# EAGLE design comcon_version_av2 (EAGLE 6.5.0)
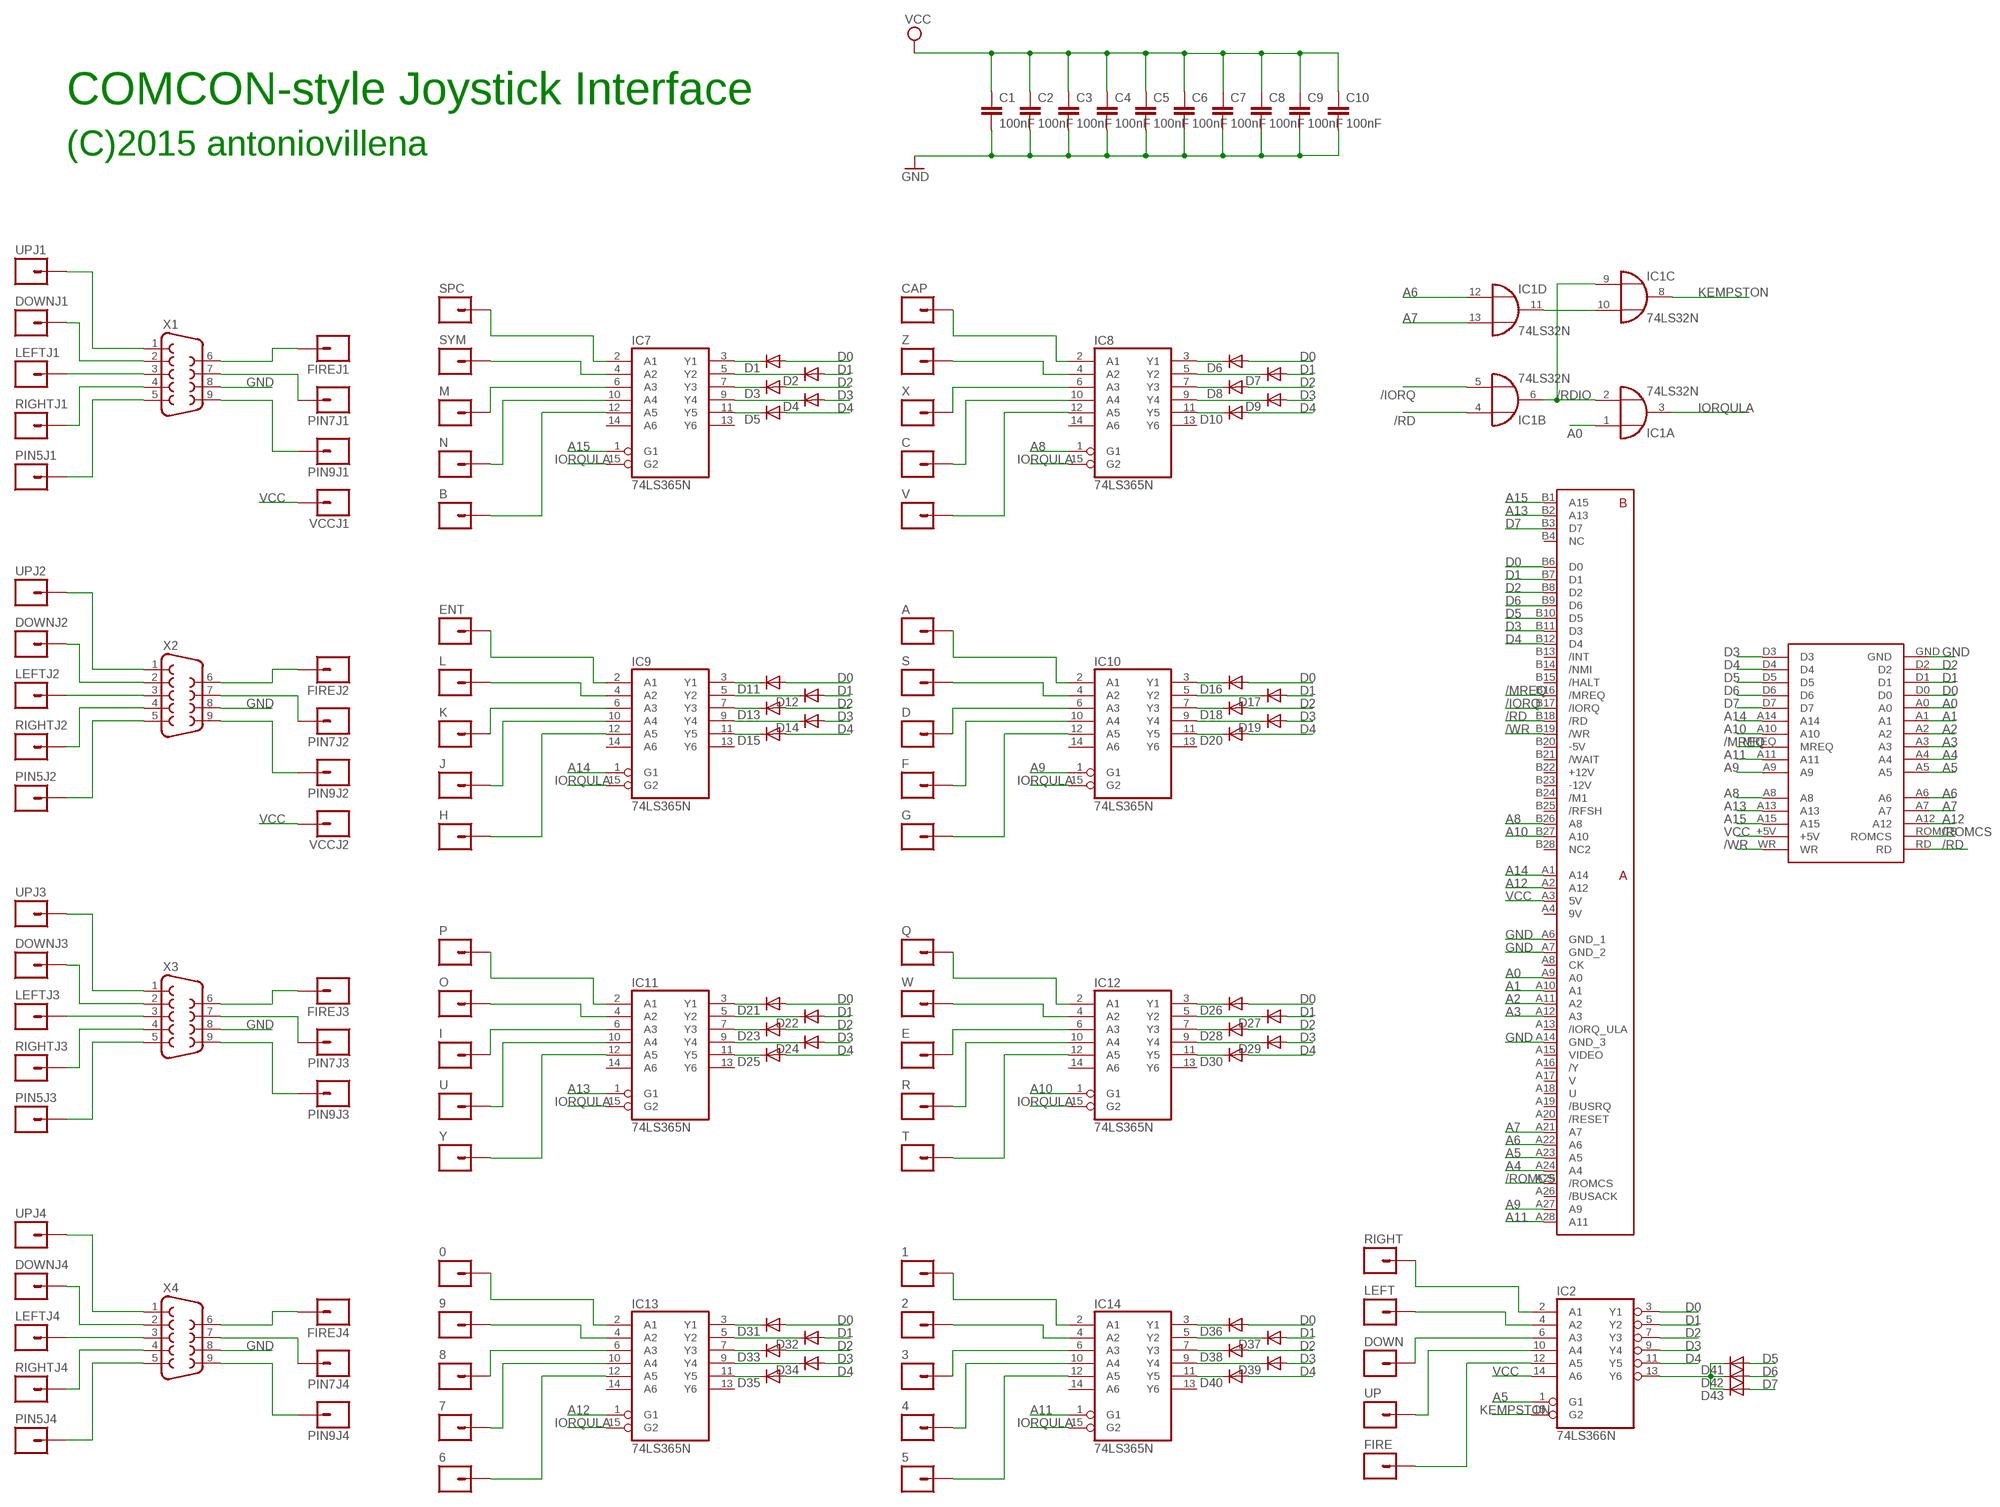
[diagram p0: schematic, sheet 1]

## Parts
0  M01PTH  [1X01]
1  M01PTH  [1X01]
2  M01PTH  [1X01]
3  M01PTH  [1X01]
4  M01PTH  [1X01]
5  M01PTH  [1X01]
6  M01PTH  [1X01]
7  M01PTH  [1X01]
8  M01PTH  [1X01]
9  M01PTH  [1X01]
A  M01PTH  [1X01]
B  M01PTH  [1X01]
C  M01PTH  [1X01]
C1  100nF  C-EU050-025X075  [C050-025X075]
C2  100nF  C-EU050-025X075  [C050-025X075]
C3  100nF  C-EU050-025X075  [C050-025X075]
C4  100nF  C-EU050-025X075  [C050-025X075]
C5  100nF  C-EU050-025X075  [C050-025X075]
C6  100nF  C-EU050-025X075  [C050-025X075]
C7  100nF  C-EU050-025X075  [C050-025X075]
C8  100nF  C-EU050-025X075  [C050-025X075]
C9  100nF  C-EU050-025X075  [C050-025X075]
C10  100nF  C-EU050-025X075  [C050-025X075]
CAP  M01PTH  [1X01]
D  M01PTH  [1X01]
D1  1N4148DO35-7  [DO35-7]
D2  1N4148DO35-7  [DO35-7]
D3  1N4148DO35-7  [DO35-7]
D4  1N4148DO35-7  [DO35-7]
D5  1N4148DO35-7  [DO35-7]
D6  1N4148DO35-7  [DO35-7]
D7  1N4148DO35-7  [DO35-7]
D8  1N4148DO35-7  [DO35-7]
D9  1N4148DO35-7  [DO35-7]
D10  1N4148DO35-7  [DO35-7]
D11  1N4148DO35-7  [DO35-7]
D12  1N4148DO35-7  [DO35-7]
D13  1N4148DO35-7  [DO35-7]
D14  1N4148DO35-7  [DO35-7]
D15  1N4148DO35-7  [DO35-7]
D16  1N4148DO35-7  [DO35-7]
D17  1N4148DO35-7  [DO35-7]
D18  1N4148DO35-7  [DO35-7]
D19  1N4148DO35-7  [DO35-7]
D20  1N4148DO35-7  [DO35-7]
D21  1N4148DO35-7  [DO35-7]
D22  1N4148DO35-7  [DO35-7]
D23  1N4148DO35-7  [DO35-7]
D24  1N4148DO35-7  [DO35-7]
D25  1N4148DO35-7  [DO35-7]
D26  1N4148DO35-7  [DO35-7]
D27  1N4148DO35-7  [DO35-7]
D28  1N4148DO35-7  [DO35-7]
D29  1N4148DO35-7  [DO35-7]
D30  1N4148DO35-7  [DO35-7]
D31  1N4148DO35-7  [DO35-7]
D32  1N4148DO35-7  [DO35-7]
D33  1N4148DO35-7  [DO35-7]
D34  1N4148DO35-7  [DO35-7]
D35  1N4148DO35-7  [DO35-7]
D36  1N4148DO35-7  [DO35-7]
D37  1N4148DO35-7  [DO35-7]
D38  1N4148DO35-7  [DO35-7]
D39  1N4148DO35-7  [DO35-7]
D40  1N4148DO35-7  [DO35-7]
D41  1N4148DO35-10  [DO35-10]
D42  1N4148DO35-10  [DO35-10]
D43  1N4148DO35-7  [DO35-7]
DOWN  M01PTH  [1X01]
DOWNJ1  M01PTH  [1X01]
DOWNJ2  M01PTH  [1X01]
DOWNJ3  M01PTH  [1X01]
DOWNJ4  M01PTH  [1X01]
E  M01PTH  [1X01]
ENT  M01PTH  [1X01]
F  M01PTH  [1X01]
FIRE  M01PTH  [1X01]
FIREJ1  M01PTH  [1X01]
FIREJ2  M01PTH  [1X01]
FIREJ3  M01PTH  [1X01]
FIREJ4  M01PTH  [1X01]
G  M01PTH  [1X01]
H  M01PTH  [1X01]
I  M01PTH  [1X01]
IC1  74LS32N  [DIL14]
IC2  74LS366N  [DIL16]
IC7  74LS365N  74HC365N  [DIL16]
IC8  74LS365N  74HC365N  [DIL16]
IC9  74LS365N  74HC365N  [DIL16]
IC10  74LS365N  74HC365N  [DIL16]
IC11  74LS365N  74HC365N  [DIL16]
IC12  74LS365N  74HC365N  [DIL16]
IC13  74LS365N  74HC365N  [DIL16]
IC14  74LS365N  74HC365N  [DIL16]
J  M01PTH  [1X01]
K  M01PTH  [1X01]
L  M01PTH  [1X01]
LEFT  M01PTH  [1X01]
LEFTJ1  M01PTH  [1X01]
LEFTJ2  M01PTH  [1X01]
LEFTJ3  M01PTH  [1X01]
LEFTJ4  M01PTH  [1X01]
M  M01PTH  [1X01]
N  M01PTH  [1X01]
O  M01PTH  [1X01]
P  M01PTH  [1X01]
PIN5J1  M01PTH  [1X01]
PIN5J2  M01PTH  [1X01]
PIN5J3  M01PTH  [1X01]
PIN5J4  M01PTH  [1X01]
PIN7J1  M01PTH  [1X01]
PIN7J2  M01PTH  [1X01]
PIN7J3  M01PTH  [1X01]
PIN7J4  M01PTH  [1X01]
PIN9J1  M01PTH  [1X01]
PIN9J2  M01PTH  [1X01]
PIN9J3  M01PTH  [1X01]
PIN9J4  M01PTH  [1X01]
Q  M01PTH  [1X01]
R  M01PTH  [1X01]
RIGHT  M01PTH  [1X01]
RIGHTJ1  M01PTH  [1X01]
RIGHTJ2  M01PTH  [1X01]
RIGHTJ3  M01PTH  [1X01]
RIGHTJ4  M01PTH  [1X01]
S  M01PTH  [1X01]
SPC  M01PTH  [1X01]
SYM  M01PTH  [1X01]
T  M01PTH  [1X01]
U  M01PTH  [1X01]
U$1  ZX_CARTRIDGE  [ZX_CARTRIDGE]
U$3  ZXSP_ED2X28_SPE  [2X28_SPE]
UP  M01PTH  [1X01]
UPJ1  M01PTH  [1X01]
UPJ2  M01PTH  [1X01]
UPJ3  M01PTH  [1X01]
UPJ4  M01PTH  [1X01]
V  M01PTH  [1X01]
VCCJ1  M01PTH  [1X01]
VCCJ2  M01PTH  [1X01]
W  M01PTH  [1X01]
X  M01PTH  [1X01]
X1  F09D  [F09D]
X2  F09D  [F09D]
X3  F09D  [F09D]
X4  F09D  [F09D]
Y  M01PTH  [1X01]
Z  M01PTH  [1X01]

## Nets
/IORQ: IC1.5(B:I1) U$3.B17(/IORQ)
/MREQ: U$1.MREQ U$3.B16(/MREQ)
/RD: IC1.4(B:I0) U$1.RD U$3.B18(/RD)
/RDIO: IC1.2(A:I1) IC1.6(B:O) IC1.9(C:I0)
/ROMCS: U$1.ROMCS U$3.A25(/ROMCS)
/WR: U$1.WR U$3.B19(/WR)
A0: IC1.1(A:I0) U$1.A0 U$3.A9(A0)
A1: U$1.A1 U$3.A10(A1)
A2: U$1.A2 U$3.A11(A2)
A3: U$1.A3 U$3.A12(A3)
A4: U$1.A4 U$3.A24(A4)
A5: IC2.1(G1) U$1.A5 U$3.A23(A5)
A6: IC1.12(D:I0) U$1.A6 U$3.A22(A6)
A7: IC1.13(D:I1) U$1.A7 U$3.A21(A7)
A8: IC8.1(G1) U$1.A8 U$3.B26(A8)
A9: IC10.1(G1) U$1.A9 U$3.A27(A9)
A10: IC12.1(G1) U$1.A10 U$3.B27(A10)
A11: IC14.1(G1) U$1.A11 U$3.A28(A11)
A12: IC13.1(G1) U$1.A12 U$3.A2(A12)
A13: IC11.1(G1) U$1.A13 U$3.B2(A13)
A14: IC9.1(G1) U$1.A14 U$3.A1(A14)
A15: IC7.1(G1) U$1.A15 U$3.B1(A15)
D0: D1.A D6.A D11.A D16.A D21.A D26.A D31.A D36.A IC2.3(Y1) U$1.D0 U$3.B6(D0)
D1: D2.A D7.A D12.A D17.A D22.A D27.A D32.A D37.A IC2.5(Y2) U$1.D1 U$3.B7(D1)
D2: D3.A D8.A D13.A D18.A D23.A D28.A D33.A D38.A IC2.7(Y3) U$1.D2 U$3.B8(D2)
D3: D4.A D9.A D14.A D19.A D24.A D29.A D34.A D39.A IC2.9(Y4) U$1.D3 U$3.B11(D3)
D4: D5.A D10.A D15.A D20.A D25.A D30.A D35.A D40.A IC2.11(Y5) U$1.D4 U$3.B12(D4)
D5: D41.A U$1.D5 U$3.B10(D5)
D6: D42.A U$1.D6 U$3.B9(D6)
D7: D43.A U$1.D7 U$3.B3(D7)
GND [power]: C1.2 C2.2 C3.2 C4.2 C5.2 C6.2 C7.2 C8.2 C9.2 C10.2 U$1.GND U$3.A6(GND_1) U$3.A7(GND_2) U$3.A14(GND_3) X1.8 X2.8 X3.8 X4.8
IORQULA: IC1.3(A:O) IC7.15(G2) IC8.15(G2) IC9.15(G2) IC10.15(G2) IC11.15(G2) IC12.15(G2) IC13.15(G2) IC14.15(G2)
KEMPSTON: IC1.8(C:O) IC2.15(G2)
N$1: D41.C D42.C D43.C IC2.13(Y6)
N$2: IC7.2(A1) SPC.1
N$3: D1.C IC7.3(Y1)
N$4: IC1.10(C:I1) IC1.11(D:O)
N$5: UPJ1.1 X1.1
N$6: DOWNJ1.1 X1.2
N$7: LEFTJ1.1 X1.3
N$8: RIGHTJ1.1 X1.4
N$9: PIN5J1.1 X1.5
N$10: FIREJ1.1 X1.6
N$11: PIN9J1.1 X1.9
N$12: IC7.4(A2) SYM.1
N$13: UPJ2.1 X2.1
N$14: DOWNJ2.1 X2.2
N$15: LEFTJ2.1 X2.3
N$16: RIGHTJ2.1 X2.4
N$17: PIN5J2.1 X2.5
N$18: IC7.6(A3) M.1
N$19: D2.C IC7.5(Y2)
N$20: IC7.10(A4) N.1
N$21: D3.C IC7.7(Y3)
N$22: B.1 IC7.12(A5)
N$23: D4.C IC7.9(Y4)
N$24: D5.C IC7.11(Y5)
N$25: CAP.1 IC8.2(A1)
N$26: IC8.4(A2) Z.1
N$27: IC8.6(A3) X.1
N$28: C.1 IC8.10(A4)
N$29: FIREJ2.1 X2.6
N$30: PIN9J2.1 X2.9
N$31: PIN7J1.1 X1.7
N$32: PIN7J2.1 X2.7
N$33: UPJ3.1 X3.1
N$34: DOWNJ3.1 X3.2
N$35: LEFTJ3.1 X3.3
N$36: IC2.2(A1) RIGHT.1
N$37: IC2.4(A2) LEFT.1
N$38: DOWN.1 IC2.6(A3)
N$39: IC2.10(A4) UP.1
N$40: FIRE.1 IC2.12(A5)
N$41: RIGHTJ3.1 X3.4
N$42: PIN5J3.1 X3.5
N$43: FIREJ3.1 X3.6
N$44: PIN9J3.1 X3.9
N$45: PIN7J3.1 X3.7
N$46: UPJ4.1 X4.1
N$47: IC8.12(A5) V.1
N$48: D6.C IC8.3(Y1)
N$49: D7.C IC8.5(Y2)
N$50: D8.C IC8.7(Y3)
N$51: D9.C IC8.9(Y4)
N$52: D10.C IC8.11(Y5)
N$53: ENT.1 IC9.2(A1)
N$54: IC9.4(A2) L.1
N$55: IC9.6(A3) K.1
N$56: IC9.10(A4) J.1
N$57: H.1 IC9.12(A5)
N$58: D11.C IC9.3(Y1)
N$59: D12.C IC9.5(Y2)
N$60: D13.C IC9.7(Y3)
N$61: D14.C IC9.9(Y4)
N$62: D15.C IC9.11(Y5)
N$63: A.1 IC10.2(A1)
N$64: IC10.4(A2) S.1
N$65: D.1 IC10.6(A3)
N$66: F.1 IC10.10(A4)
N$67: G.1 IC10.12(A5)
N$68: D16.C IC10.3(Y1)
N$69: D17.C IC10.5(Y2)
N$70: D18.C IC10.7(Y3)
N$71: D19.C IC10.9(Y4)
N$72: D20.C IC10.11(Y5)
N$73: DOWNJ4.1 X4.2
N$74: IC11.2(A1) P.1
N$75: IC11.4(A2) O.1
N$76: I.1 IC11.6(A3)
N$77: IC11.10(A4) U.1
N$78: IC11.12(A5) Y.1
N$79: D21.C IC11.3(Y1)
N$80: D22.C IC11.5(Y2)
N$81: D23.C IC11.7(Y3)
N$82: D24.C IC11.9(Y4)
N$83: D25.C IC11.11(Y5)
N$84: IC12.2(A1) Q.1
N$85: IC12.4(A2) W.1
N$86: E.1 IC12.6(A3)
N$87: IC12.10(A4) R.1
N$88: IC12.12(A5) T.1
N$89: D26.C IC12.3(Y1)
N$90: D27.C IC12.5(Y2)
N$91: D28.C IC12.7(Y3)
N$92: D29.C IC12.9(Y4)
N$93: D30.C IC12.11(Y5)
N$94: 0.1 IC13.2(A1)
N$95: 9.1 IC13.4(A2)
N$96: 8.1 IC13.6(A3)
N$97: 7.1 IC13.10(A4)
N$98: 6.1 IC13.12(A5)
N$99: D31.C IC13.3(Y1)
N$100: D32.C IC13.5(Y2)
N$101: D33.C IC13.7(Y3)
N$102: D34.C IC13.9(Y4)
N$103: D35.C IC13.11(Y5)
N$104: 1.1 IC14.2(A1)
N$105: 2.1 IC14.4(A2)
N$106: 3.1 IC14.6(A3)
N$107: 4.1 IC14.10(A4)
N$108: 5.1 IC14.12(A5)
N$109: D36.C IC14.3(Y1)
N$110: D37.C IC14.5(Y2)
N$111: D38.C IC14.7(Y3)
N$112: D39.C IC14.9(Y4)
N$113: D40.C IC14.11(Y5)
N$114: LEFTJ4.1 X4.3
N$115: RIGHTJ4.1 X4.4
N$116: PIN5J4.1 X4.5
N$117: FIREJ4.1 X4.6
N$118: PIN9J4.1 X4.9
N$119: PIN7J4.1 X4.7
VCC [power]: C1.1 C2.1 C3.1 C4.1 C5.1 C6.1 C7.1 C8.1 C9.1 C10.1 IC2.14(A6) U$1.+5V U$3.A3(5V) VCCJ1.1 VCCJ2.1
Unconnected: IC7.13(Y6) IC7.14(A6) IC8.13(Y6) IC8.14(A6) IC9.13(Y6) IC9.14(A6) IC10.13(Y6) IC10.14(A6) IC11.13(Y6) IC11.14(A6) IC12.13(Y6) IC12.14(A6) IC13.13(Y6) IC13.14(A6) IC14.13(Y6) IC14.14(A6) U$3.A8(CK) U$3.A13(/IORQ_ULA) U$3.A15(VIDEO) U$3.A16(/Y) U$3.A17(V) U$3.A18(U) U$3.A19(/BUSRQ) U$3.A20(/RESET) U$3.A26(/BUSACK) U$3.B4(NC) U$3.B13(/INT) U$3.B14(/NMI) U$3.B15(/HALT) U$3.B21(/WAIT) U$3.B24(/M1) U$3.B25(/RFSH) U$3.B28(NC2)

## Notes on the sheet
- COMCON-style Joystick Interface
- (C)2015 antoniovillena

## Power pins joined to a net without a drawn wire
9V: U$3.A4(9V)
+12V: U$3.B22(+12V)
-5V: U$3.B20(-5V)
-12V: U$3.B23(-12V)
GND: IC1.7(P:GND) IC2.8(GND) IC7.8(GND) IC8.8(GND) IC9.8(GND) IC10.8(GND) IC11.8(GND) IC12.8(GND) IC13.8(GND) IC14.8(GND)
VCC: IC1.14(P:VCC) IC2.16(VCC) IC7.16(VCC) IC8.16(VCC) IC9.16(VCC) IC10.16(VCC) IC11.16(VCC) IC12.16(VCC) IC13.16(VCC) IC14.16(VCC)

## Library data of the parts
0 1-9 A B C CAP D DOWN DOWNJ1-DOWNJ4 E ENT F FIRE FIREJ1-FIREJ4 G H I J K L LEFT LEFTJ1-LEFTJ4 M N O P PIN5J1-PIN5J4 PIN7J1-PIN7J4 PIN9J1-PIN9J4 Q R RIGHT RIGHTJ1-RIGHTJ4 S SPC SYM T U UP UPJ1-UPJ4 V VCCJ1 VCCJ2 W X Y Z = SparkFun-Connectors:M01: Header 1 Standard 1-pin 0.1" header. Use with straight break away headers (SKU : PRT-00116), right angle break away headers (PRT-00553), swiss pins (PRT-00743), machine pins (PRT-00117), and female headers (PRT-00115).
C1-C10 = rcl:C-EU: CAPACITOR, European symbol
D1-D43 = diode:1N4148: DIODE high speed (Philips)
IC1 = 74xx-eu:74*32: Quad 2-input OR gate
IC2 = 74xx-eu:74*366: Hex BUS DRIVER, 3-state
IC7-IC14 = 74xx-eu:74*365: Hex BUS DRIVER, 3-state
U$1 = 8Bit_Parts:ZX_CARTRIDGE
U$3 = zx_edge:ZXSP_ED
X1-X4 = con-subd:F09: SUB-D; OC_FARNELL: unknown; OC_NEWARK: unknown

## Net classes
1 power: width 0.508 mm, clearance 0.254 mm to class 0, clearance 0.254 mm

## Board
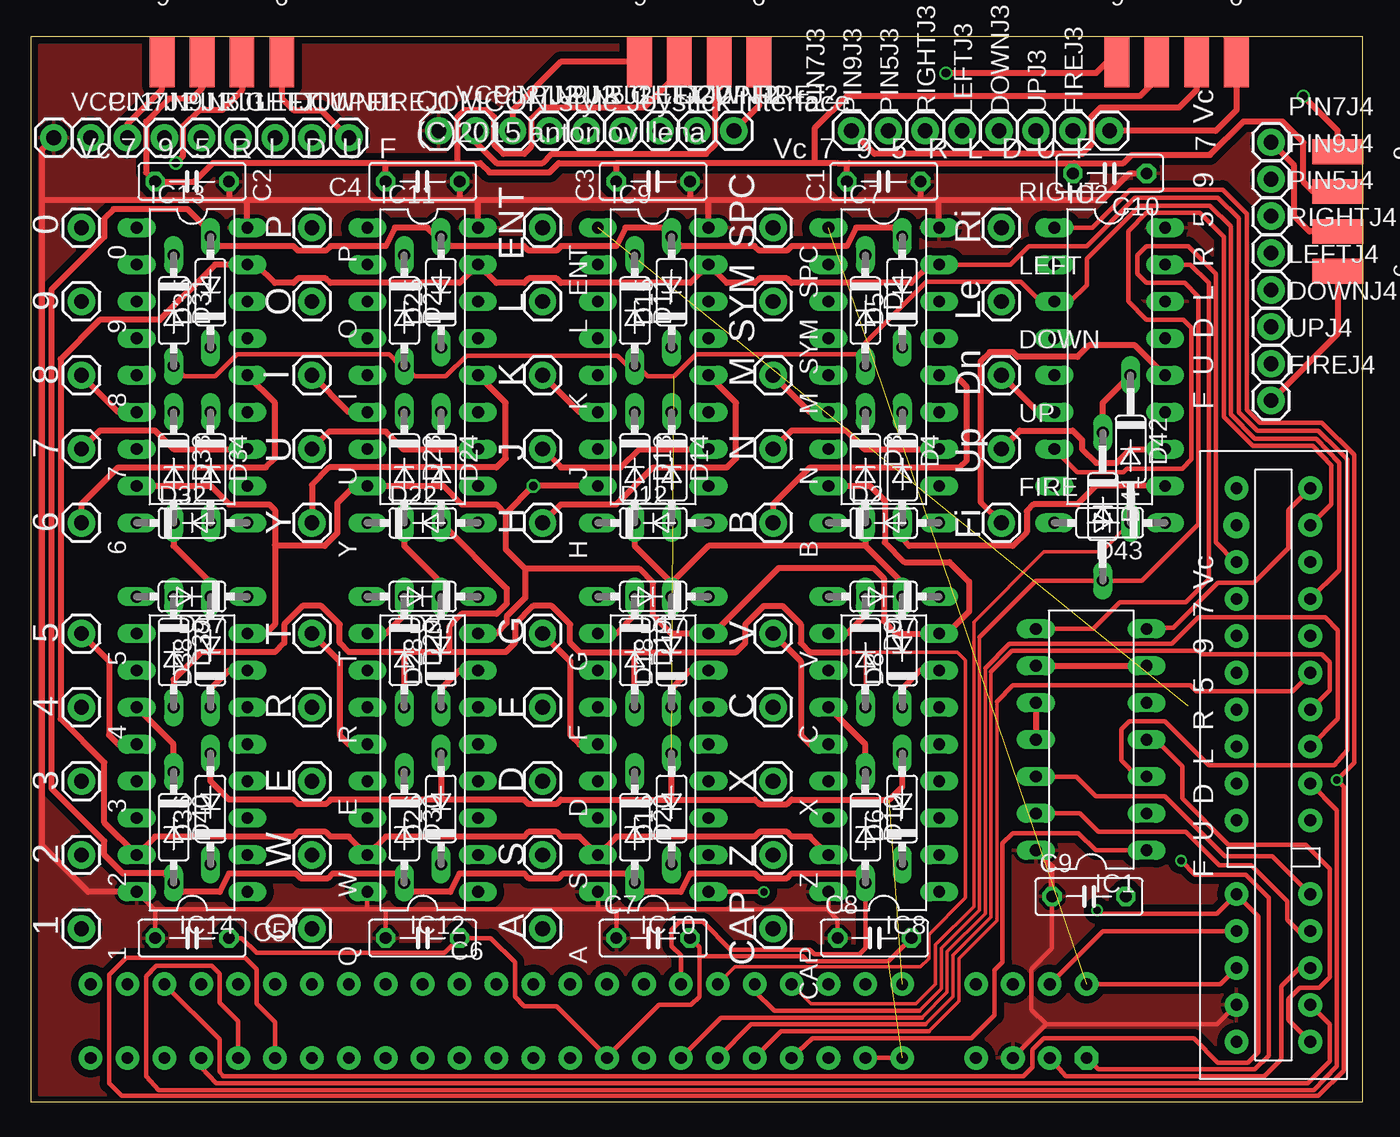
[diagram p1: board, top side]
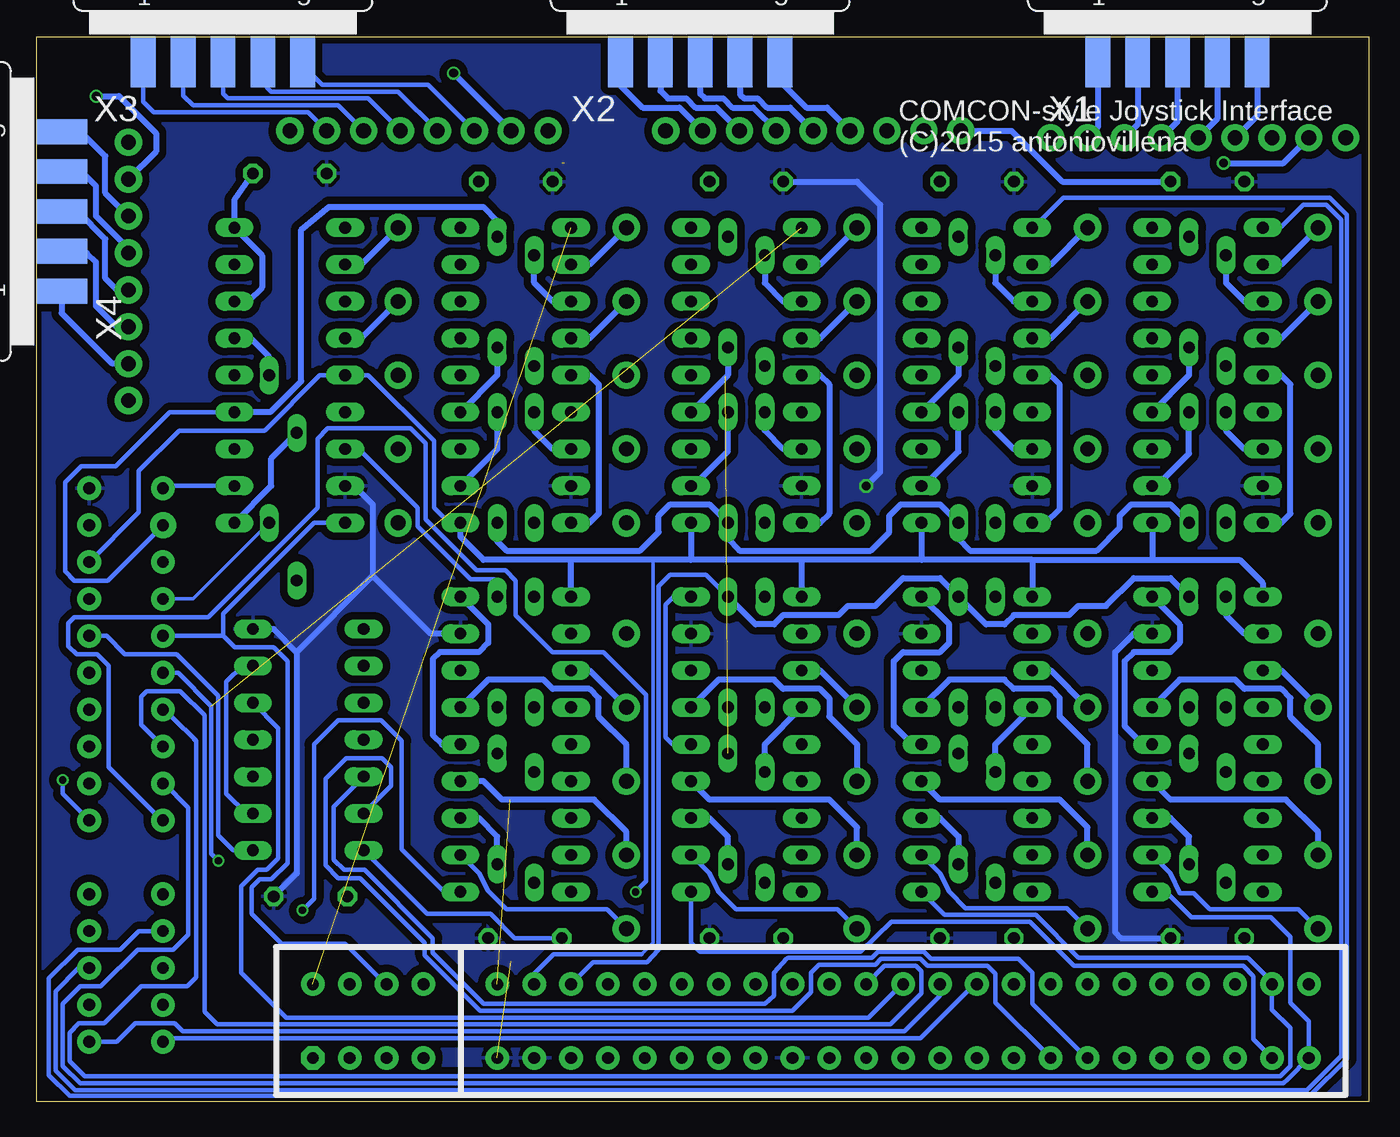
[diagram p2: board, bottom side, seen from below]

No outline drawn. Coordinates in mm, seen from the top.
Copper layers (1*16): Top 0.035mm / dielectric 1.5mm / Bottom 0.035mm
Design rules "seedstudio_Fusion_eagle_rule_v1.1 *": minimum track width 7mil, minimum drill 12mil, track to track 8mil, track to pad 10mil, pad to pad 6mil, via to via 10mil, smd to smd 0mil, copper to edge 10mil, drill to drill 10mil, minimum pad ring 10mil, minimum via ring 6mil, stop-mask expansion 2mil, vias tented up to drill 100mil, thermal gap 10mil
Milling: 4 lines

### Footprints (pad centres in the part's own frame; a part is rotated, then mirrored left to right if it is on the bottom)
1X01 = drill 1.016 pad 1.88: 1 0,0
C050-025X075 = drill 0.813 octagon: 1 -2.54,0; 2 2.54,0
DO35-7 = drill 0.813 long: A 3.81,0; C -3.81,0
DO35-10 = drill 0.813 long: A 5.08,0; C -5.08,0
DIL14 = drill 0.813 long: 1 -7.62,-3.81; 2 -5.08,-3.81; 3 -2.54,-3.81; 4 0,-3.81; 5 2.54,-3.81; 6 5.08,-3.81; 7 7.62,-3.81; 8 7.62,3.81; 9 5.08,3.81; 10 2.54,3.81; 11 0,3.81; 12 -2.54,3.81; 13 -5.08,3.81; 14 -7.62,3.81
DIL16 = drill 0.813 long: 1 -8.89,-3.81; 2 -6.35,-3.81; 3 -3.81,-3.81; 4 -1.27,-3.81; 5 1.27,-3.81; 6 3.81,-3.81; 7 6.35,-3.81; 8 8.89,-3.81; 9 8.89,3.81; 10 6.35,3.81; 11 3.81,3.81; 12 1.27,3.81; 13 -1.27,3.81; 14 -3.81,3.81; 15 -6.35,3.81; 16 -8.89,3.81
ZX_CARTRIDGE = drill 0.813 pad 1.626: +5V 17.78,-2.54; A0 -7.62,2.54; A1 -5.08,2.54; A2 -2.54,2.54; A3 0,2.54; A4 2.54,2.54; A5 5.08,2.54; A6 10.16,2.54; A7 12.7,2.54; A8 10.16,-2.54; A9 5.08,-2.54; A10 -2.54,-2.54; A11 2.54,-2.54; A12 15.24,2.54; A13 12.7,-2.54; A14 -5.08,-2.54; A15 15.24,-2.54; D0 -10.16,2.54; D1 -12.7,2.54; D2 -15.24,2.54; D3 -17.78,-2.54; D5 -12.7,-2.54; D6 -10.16,-2.54; D7 -7.62,-2.54; GND -17.78,2.54; MREQ 0,-2.54; RD 20.32,2.54; ROMCS 17.78,2.54; WR 20.32,-2.54 | drill 0.813 pad 1.788: D4 -15.24,-2.54
2X28_SPE = drill 0.813 pad 1.626 octagon: A1 0,-5.08 | drill 0.813 pad 1.626: A2 2.54,-5.08; A3 5.08,-5.08; A4 7.62,-5.08; A6 12.7,-5.08; A7 15.24,-5.08; A8 17.78,-5.08; A9 20.32,-5.08; A10 22.86,-5.08; A11 25.4,-5.08; A12 27.94,-5.08; A13 30.48,-5.08; A14 33.02,-5.08; A15 35.56,-5.08; A16 38.1,-5.08; A17 40.64,-5.08; A18 43.18,-5.08; A19 45.72,-5.08; A20 48.26,-5.08; A21 50.8,-5.08; A22 53.34,-5.08; A23 55.88,-5.08; A24 58.42,-5.08; A25 60.96,-5.08; A26 63.5,-5.08; A27 66.04,-5.08; A28 68.58,-5.08; B1 0,0; B2 2.54,0; B3 5.08,0; B4 7.62,0; B6 12.7,0; B7 15.24,0; B8 17.78,0; B9 20.32,0; B10 22.86,0; B11 25.4,0; B12 27.94,0; B13 30.48,0; B14 33.02,0; B15 35.56,0; B16 38.1,0; B17 40.64,0; B18 43.18,0; B19 45.72,0; B20 48.26,0; B21 50.8,0; B22 53.34,0; B23 55.88,0; B24 58.42,0; B25 60.96,0; B26 63.5,0; B27 66.04,0; B28 68.58,0
F09D = smd 1.7 x 3.5: 1 -5.486,-6.045; 2 -2.743,-6.045; 3 0,-6.045; 4 2.743,-6.045; 5 5.486,-6.045 | smd 1.7 x 3.5 bottom: 6 -4.115,-6.045; 7 -1.372,-6.045; 8 1.372,-6.045; 9 4.115,-6.045

### Placement (x,y rotation side)
0  3.49,60.17 270 top
1  3.49,11.91 270 top
2  3.49,16.99 270 top
3  3.49,22.07 270 top
4  3.49,27.15 270 top
5  3.49,32.23 270 top
6  3.49,39.85 270 top
7  3.49,44.93 270 top
8  3.49,50.01 270 top
9  3.49,55.09 270 top
A  35.24,11.91 270 top
B  51.12,39.85 270 top
C  51.12,27.15 270 top
C1  58.74,63.34 180 top
C2  11.11,63.34 180 top
C3  42.86,63.34 180 top
C4  26.99,63.34 180 top
C5  11.11,11.27 0 top
C6  26.99,11.27 0 top
C7  42.86,11.27 0 top
C8  58.1,11.27 0 top
C9  72.87,14.13 0 top
C10  74.3,63.9 180 top
CAP  51.12,11.91 270 top
D  35.24,22.07 270 top
D1  57.47,54.45 270 top
D2  58.74,39.85 0 top
D3  57.47,43.66 270 top
D4  60.01,43.66 270 top
D5  60.01,55.72 90 top
D6  60.01,20.16 90 top
D7  58.74,34.77 180 top
D8  60.01,30.96 90 top
D9  57.47,30.96 270 top
D10  57.47,18.89 270 top
D11  41.59,54.45 270 top
D12  42.86,39.85 0 top
D13  41.59,43.66 270 top
D14  44.13,43.66 270 top
D15  44.13,55.72 90 top
D16  44.13,20.16 90 top
D17  42.86,34.77 180 top
D18  44.13,30.96 90 top
D19  41.59,30.96 270 top
D20  41.59,18.89 270 top
D21  25.72,54.45 270 top
D22  26.99,39.85 0 top
D23  25.72,43.66 270 top
D24  28.26,43.66 270 top
D25  28.26,55.72 90 top
D26  28.26,20.16 90 top
D27  26.99,34.77 180 top
D28  28.26,30.96 90 top
D29  25.72,30.96 270 top
D30  25.72,18.89 270 top
D31  9.84,54.45 270 top
D32  11.11,39.85 0 top
D33  9.84,43.66 270 top
D34  12.38,43.66 270 top
D35  12.38,55.72 90 top
D36  12.38,20.16 90 top
D37  11.11,34.77 180 top
D38  12.38,30.96 90 top
D39  9.84,30.96 270 top
D40  9.84,18.89 270 top
D41  73.82,40.96 270 top
D42  75.72,44.93 270 top
D43  74.3,39.85 180 top
DOWN  66.83,50.01 0 top
DOWNJ1  16.83,66.36 0 top
DOWNJ2  43.34,66.83 0 top
DOWNJ3  69.22,66.83 90 top
DOWNJ4  85.41,53.34 0 top
E  19.37,22.07 270 top
ENT  35.24,60.17 270 top
F  35.24,27.15 270 top
FIRE  66.83,39.85 0 top
FIREJ1  21.91,66.36 0 top
FIREJ2  48.42,66.83 0 top
FIREJ3  74.3,66.83 90 top
FIREJ4  85.41,48.26 0 top
G  35.24,32.23 270 top
H  35.24,39.85 270 top
I  19.37,50.01 270 top
IC1  73.03,24.92 90 top
IC2  74.3,51.28 270 top
IC7  58.74,51.28 270 top
IC8  58.74,23.34 90 top
IC9  42.86,51.28 270 top
IC10  42.86,23.34 90 top
IC11  26.99,51.28 270 top
IC12  26.99,23.34 90 top
IC13  11.11,51.28 270 top
IC14  11.11,23.34 90 top
J  35.24,44.93 270 top
K  35.24,50.01 270 top
L  35.24,55.09 270 top
LEFT  66.83,55.09 0 top
LEFTJ1  14.29,66.36 0 top
LEFTJ2  40.8,66.83 0 top
LEFTJ3  66.67,66.83 90 top
LEFTJ4  85.41,55.88 0 top
M  51.12,50.01 270 top
N  51.12,44.93 270 top
O  19.37,55.09 270 top
P  19.37,60.17 270 top
PIN5J1  9.21,66.36 0 top
PIN5J2  35.72,66.83 0 top
PIN5J3  61.59,66.83 90 top
PIN5J4  85.41,60.96 0 top
PIN7J1  4.13,66.36 0 top
PIN7J2  30.64,66.83 0 top
PIN7J3  56.52,66.83 90 top
PIN7J4  85.41,66.04 0 top
PIN9J1  6.67,66.36 0 top
PIN9J2  33.18,66.83 0 top
PIN9J3  59.05,66.83 90 top
PIN9J4  85.41,63.5 0 top
Q  19.37,11.91 270 top
R  19.37,27.15 270 top
RIGHT  66.83,60.17 0 top
RIGHTJ1  11.75,66.36 0 top
RIGHTJ2  38.26,66.83 0 top
RIGHTJ3  64.14,66.83 90 top
RIGHTJ4  85.41,58.42 0 top
S  35.24,16.99 270 top
SPC  51.12,60.17 270 top
SYM  51.12,55.09 270 top
T  19.37,32.23 270 top
U  19.37,44.93 270 top
U$1  85.57,24.45 270 top
U$3  72.71,8.1 0 bottom
UP  66.83,44.93 0 top
UPJ1  19.37,66.36 0 top
UPJ2  45.88,66.83 0 top
UPJ3  71.75,66.83 90 top
UPJ4  85.41,50.8 0 top
V  51.12,32.23 270 top
VCCJ1  1.59,66.36 0 top
VCCJ2  28.1,66.83 0 top
W  19.37,16.99 270 top
X  51.12,22.07 270 top
X1  13.18,77.63 0 bottom
X2  46.04,77.63 0 bottom
X3  78.9,77.63 0 bottom
X4  96.04,61.28 90 bottom
Y  19.37,39.85 270 top
Z  51.12,16.99 270 top

### Tracks (layer width: path | path; a pad name or v marks a point on that pad's centre or on a via)
/IORQ
  Bottom 0.305: U$3.B17 32.15,8.1 34.45,5.79 74.53,5.79 77.63,8.89 77.63,14.84 76.52,15.95 75.88,15.95 75.09,16.75 75.09,25.72 IC1.5
/MREQ
  Bottom 0.305: U$3.B16 33.34,9.37 31.19,9.37 30.8,8.97 30.8,7.46 32.94,5.32 79.3,5.32 80.17,6.19 80.17,26.59 81.84,28.26 84.14,28.26 84.53,27.86 84.53,25.96 U$1.MREQ
/RD
  Top 0.305: IC1.4 77.47,24.92 79.3,23.1 79.3,20.88 82.47,17.7 87.79,17.7 89.46,16.03 89.46,8.57 88.74,7.86 87.39,7.86 86.6,7.06 86.6,5.64 U$1.RD
  Bottom 0.305: U$1.RD 86.2,4.13 84.93,5.4 82.23,5.4 81.68,4.84 31.99,4.84 29.53,7.3 U$3.B18
/RDIO
  Top 0.406: IC1.9 IC1.6
  Bottom 0.305: IC1.2 77.31,19.84 78.66,21.19 78.66,28.89 77.55,30 IC1.6
/ROMCS
  Top 0.305: U$3.A25 11.75,2.38 12.78,1.27 87.95,1.27 89.46,2.78 89.46,5.32 U$1.ROMCS
/WR
  Bottom 0.305: U$3.B19 27.15,8.1 30.88,4.37 82.79,4.37 U$1.WR
A0
  Top 0.305: U$3.A9 53.82,4.37 64.77,4.37 66.36,5.95 66.36,9.05 66.91,9.6 66.91,17.78 67.63,18.49 72.15,18.49 73.34,17.3 IC1.1
  Bottom 0.305: IC1.1 78.18,17.3 79.22,18.34 79.22,27.94 82.07,30.8 85.65,30.8 86.92,32.07 U$1.A0
A1
  Top 0.254: 61.83,4.84 63.9,6.91 63.9,9.84 66.52,12.46 66.52,27.54
  Top 0.305: U$3.A10 51.67,4.84 61.83,4.84 | U$1.A1 88.11,29.45 86.92,28.26 80.25,28.26 79.85,28.65 67.63,28.65 66.52,27.54
A2
  Top 0.254: 61.59,5.32 63.5,7.22 63.5,10.08 66.12,12.7 66.12,29.61
  Top 0.305: U$3.A11 49.61,5.32 61.59,5.32 | U$1.A2 89.46,28.34 89.46,30.24 88.9,30.8 80.64,30.8 80.41,31.04 67.55,31.04 66.12,29.61
A3
  Top 0.254: 61.36,5.79 63.1,7.54 63.1,10.32 65.72,12.94 65.72,29.84
  Top 0.305: U$1.A3 90.01,26.35 90.01,32.46 89.14,33.34 80.41,33.34 78.58,31.51 67.39,31.51 65.72,29.84 | 61.36,5.79 47.55,5.79 U$3.A12
A4
  Top 0.305: U$3.A24 14.29,5.56 13.02,6.83 13.02,8.81 12.46,9.37 8.65,9.37 7.94,8.65 7.94,1.75 8.81,0.79 88.34,0.79 89.93,2.46 89.93,20.08 U$1.A4
A5  (via drill 0.5)
  Top 0.305: U$3.A23 16.83,5.48 15.56,6.75 15.56,9.13 14.76,9.92 6.59,9.92 5.4,8.73 5.4,1.27 6.27,0.4 88.66,0.4 90.41,2.14 90.41,21.67 v89.93,22.15 91.12,23.34 91.12,44.53 88.9,46.75 84.61,46.75 83.74,47.62 83.74,61.12 82.07,62.79 75.72,62.79 73.1,60.17 IC2.1
  Bottom 0.305: v89.93,22.15 89.93,21.19 U$1.A5
A6
  Top 0.305: IC1.12 71.99,22.38 73.34,21.03 78.11,21.03 82.23,16.91 85.49,16.91 U$1.A6
  Bottom 0.305: U$3.A22 19.45,3.02 23.18,6.75 23.18,8.89 24.13,9.84 30.16,9.84 30.64,10.32 33.81,10.32 34.21,9.92 40.01,9.92 40.08,9.84 40.96,8.89 40.96,7.3 41.59,6.75 60.96,6.75 64.45,10.24 64.45,11.27 69.14,15.95 70.56,15.95 71.28,16.67 71.28,20.32 IC1.12
A7
  Top 0.305: IC1.13 72.23,19.84 73.5,18.57 79.53,18.57 81.84,16.27 84.06,16.27 86.52,13.81 86.52,12.54 87.39,11.67 88.03,11.67 U$1.A7
  Bottom 0.305: U$3.A21 25.72,6.83 25.72,8.81 26.27,9.37 30.4,9.37 30.88,9.84 33.58,9.84 33.97,9.45 37.86,9.45 38.42,8.89 38.42,7.54 39.69,6.27 61.2,6.27 65.01,10.08 65.01,10.95 69.45,15.4 70.96,15.4 71.83,16.27 71.83,22.23 70.41,23.65 67.94,23.65 67.31,23.02 67.31,21.75 IC1.13
A8  (via drill 0.5)
  Top 0.305: U$3.B26 13.02,4.29 13.02,2.06 13.26,1.75 68.34,1.75 68.98,2.38 68.98,3.57 69.77,4.37 80.09,4.37 81.76,2.7 83.82,2.7 84.53,3.41 84.53,12.78 U$1.A8 81.68,12.94 73.66,12.94 v73.42,13.18
  Bottom 0.305: IC8.1 63.66,14.45 66.6,17.38 66.6,24.84 68.02,26.27 70.96,26.27 72.63,24.61 72.63,13.97 v73.42,13.18
A9  (via drill 0.5)
  Top 0.305: v50.48,14.45 IC10.1
  Bottom 0.305: IC10.1 46.67,10.95 46.04,10.32 35,10.32 32.86,12.38 23.34,12.38 20.32,9.37 8.65,9.37 7.94,8.65 7.94,4.29 U$3.A27 | U$1.A9 83.11,19.37 86.76,23.02 86.76,30 87.55,30.8 88.98,30.8 89.53,31.35 89.53,32.94 89.14,33.34 79.93,33.34 72.39,40.88 72.39,45.64 71.68,46.35 65.96,46.35 64.93,45.32 64.93,40.08 61.44,36.59 59.45,36.59 58.74,35.88 58.74,33.5 56.2,30.96 52.7,30.96 49.77,28.02 49.77,15.16 v50.48,14.45
A10
  Bottom 0.305: U$1.A10 82.95,26.99 81.13,25.23 | 81.13,25.23 80.72,24.84 | IC12.1 29.21,12.86 22.94,12.86 20,9.92 8.33,9.92 6.67,8.26 U$3.B27 6.67,6.35 5.4,5.08 5.4,2.46 6.11,1.75 88.42,1.75 89.46,2.78 89.46,4.76 88.82,5.4 87.07,5.4 84.53,7.94 81.36,7.94 80.72,8.57 80.72,24.83 81.13,25.23
A11
  Bottom 0.305: IC14.1 13.97,14.45 12.22,12.7 6.75,12.7 5.4,11.35 5.4,6.83 4.13,5.56 U$3.A28 5.6,1.55 5.87,1.27 88.74,1.27 89.93,2.46 89.93,6.75 88.74,7.94 87.31,7.94 84.77,10.48 82.31,10.48 81.28,11.51 81.28,20.24 82.95,21.91 U$1.A11
A12
  Top 0.305: U$3.A2 71.28,1.75 84.93,1.75 86.12,2.94 86.12,7.94 87.39,9.21 U$1.A12
  Bottom 0.305: IC13.1 6.11,60.17 4.52,61.75 2.94,61.75 1.91,60.72 1.91,3.17 4.29,0.79 89.06,0.79 90.41,2.14 90.41,7.62 88.82,9.21 U$1.A12
A13
  Top 0.305: U$1.A13 73.82,11.75 U$3.B2
  Bottom 0.305: IC11.1 23.1,60.17 21.03,62.23 2.7,62.23 1.51,61.04 1.51,2.94 4.05,0.4 89.46,0.4 90.88,1.83 90.88,8.49 88.9,10.48 85.96,10.48 84.69,11.75 U$1.A13
A14  (via drill 0.5)  (1 unrouted)
  Top 0.305: U$3.A1 73.5,2.22 84.3,2.22 85.25,3.17 85.25,14.05 83.66,15.64 80.17,15.64 v79.22,16.59
  Bottom 0.305: U$1.A14 81.99,29.53 79.69,27.23 79.69,17.07 v79.22,16.59
A15  (1 unrouted)
  Top 0.305: U$3.B1 81.92,8.1 U$1.A15
D0  (2 unrouted)
  Top 0.305: U$1.D0 90.09,36.59 90.09,43.97 88.5,45.64 84.3,45.64 82.63,47.31 82.63,60.25 81.2,61.67 76.36,61.67 72.71,58.02 72.71,56.2 71.6,55.09 IC2.3 69.53,55.09 68.18,56.44 61.67,56.44 57.47,52.23 57.47,51.44 | 57.47,51.44 D1.A | 57.47,51.44 45.8,51.44 44.29,49.93 42.47,49.93 41.75,50.64 D11.A 41.12,50.64 40.4,51.36 30,51.36 28.57,49.93 26.43,49.93 D21.A 25.48,50.64 24.69,51.44 14.21,51.44 12.7,49.93 10.56,49.93 D31.A
  Top 0.406: D26.A 28.26,20.8 | 28.26,20.8 33.97,20.8 34.29,20.48 36.2,20.48 36.51,20.8 44.13,20.8 | 28.26,20.8 20.64,20.8 20.32,20.48 18.41,20.48 18.1,20.8 13.65,20.8 12.38,22.07 D36.A | 44.13,20.8 D16.A | 44.13,20.8 49.85,20.8 50.16,20.48 52.07,20.48 52.39,20.8 59.13,20.8 60.01,21.67 D6.A
D1
  Bottom 0.254: 49.29,37.31 49.29,10.95 50.09,10.16
  Bottom 0.305: 50.09,10.16 56.12,10.16 57.47,8.81 U$3.B7 | D2.A 63.34,39.85 64.37,40.88 64.37,45.48 68.9,50.01 IC2.5 72.23,50.01 76.04,46.2 81.92,46.2 84.69,43.42 84.69,40.56 U$1.D1
  Bottom 0.406: 23.18,37.31 D27.A | 39.05,37.31 D17.A | 54.93,37.31 60.96,37.31 62.55,38.89 D2.A | D7.A 54.93,37.31 | 23.18,37.31 14.92,37.31 | 14.92,37.31 8.89,37.31 7.3,35.72 D37.A | 23.18,37.31 30.8,37.31 | 30.8,37.31 39.05,37.31 | 39.05,37.31 46.67,37.31 | 46.67,37.31 49.29,37.31 54.93,37.31 | D12.A 46.67,37.31 | D22.A 30.8,37.31 | D32.A 14.92,37.31
D2
  Top 0.305: IC2.7 72.07,43.34 75.25,43.34 75.49,43.58 79.3,43.58 79.93,44.21 79.93,53.26 79.38,53.82 76.83,53.82 75.56,55.09 75.56,59.93 76.83,61.2 80.49,61.2 82.15,59.53 82.15,47.15 84.14,45.16 88.27,45.16 89.53,43.81 89.53,41.12 U$1.D2
  Top 0.406: D23.A 25.72,38.26 28.26,35.72 D28.A | D33.A 9.84,38.26 12.38,35.72 D38.A | D13.A 41.59,38.26 44.13,35.72 | 44.13,35.72 D18.A | D3.A 57.47,38.26 | 57.47,38.26 60.01,35.72 D8.A | 57.47,38.26 46.67,38.26 44.13,35.72
  Bottom 0.305: U$3.B8 53.42,9.6 49.69,9.6 48.9,10.48 48.9,35.48 48.1,36.27 45.64,36.27 D18.A | IC2.7 69.53,44.93 65.48,40.88 65.48,39.61 61.83,35.96 60.25,35.96 60.01,35.72 D8.A
  Bottom 0.406: D18.A 42.23,32.86 40.96,32.86 40.32,33.5 36.51,33.5 35.88,34.13 33.97,34.13 32.07,36.04 29.53,36.04 D28.A 26.35,32.86 25.08,32.86 24.45,33.5 20.64,33.5 20,34.13 18.1,34.13 16.19,36.04 13.65,36.04 D38.A
D3
  Top 0.254: U$3.B11 48.5,9.29 61.28,9.29 61.83,9.84 61.83,11.51 64.37,14.05 64.37,30.4 63.82,30.96 57.63,30.96 | 56.2,30.96 57.63,30.96 | D9.A 57.47,30.8 57.63,30.96
  Top 0.406: D19.A 41.59,30.96 | 25.72,30.96 D29.A | 28.81,30.96 32.7,30.96 33.34,31.59 33.34,32.86 34.61,34.13 35.88,34.13 37.15,32.86 37.15,31.59 37.78,30.96 41.59,30.96 | 28.81,30.96 25.72,30.96 | 25.72,30.96 21.91,30.96 21.27,31.59 21.27,32.86 20,34.13 18.73,34.13 17.46,32.86 17.46,31.59 16.83,30.96 11.75,30.96 9.84,29.05 D39.A | 41.59,30.96 48.58,30.96 49.21,31.59 49.21,32.86 50.48,34.13 51.75,34.13 53.02,32.86 53.02,31.59 53.66,30.96 56.2,30.96 | IC2.9 73.34,42.39 72.07,41.12 69.06,41.12 68.58,40.64 68.58,39.21 67.63,38.26 60.48,38.26 60.01,38.73 D4.A | D24.A 32.78,35.32 32.78,34.29 32.07,33.58 29.69,33.58 28.81,32.7 28.81,30.96
  Bottom 0.305: IC2.9 82.87,42.39 U$1.D3
  Bottom 0.406: D4.A 60.01,38.58 59.37,37.94 50.16,37.94 48.9,39.21 48.9,40.32 48.1,41.12 45.4,41.12 D14.A 44.13,38.73 43.34,37.94 34.29,37.94 33.02,39.21 33.02,40.32 32.23,41.12 29.53,41.12 D24.A 28.26,38.73 27.46,37.94 18.73,37.94 17.14,39.53 17.14,40.32 16.35,41.12 13.65,41.12 D34.A
D4
  Top 0.305: U$3.B12 44.77,10.08 44.13,10.72 44.13,11.83 44.69,12.38 46.28,12.38 48.18,10.48 53.66,10.48 53.98,10.16 57.07,10.16 57.47,10.56 D10.A
  Top 0.406: D5.A 59.37,60.17 56.83,60.17 56.2,58.9 52.39,58.9 52.07,58.58 50.16,58.58 49.85,58.9 44.77,58.9 D15.A 43.5,60.17 40.96,60.17 40.32,58.9 36.51,58.9 36.2,58.58 34.29,58.58 33.97,58.9 28.89,58.9 D25.A 27.94,59.53 27.3,60.17 25.08,60.17 24.45,58.9 20.64,58.9 20.32,58.58 18.41,58.58 18.1,58.9 13.02,58.9 D35.A 12.38,59.85 10.79,61.44 5.71,61.44 5.08,60.8 5.08,59.53 1.43,55.88 1.43,21.59 5.08,17.94 5.08,16.99 6.35,15.72 9.21,15.72 D40.A 10.48,14.45 13.02,14.45 13.65,15.72 18.26,15.72 18.57,15.4 20.48,15.4 20.8,15.72 25.08,15.72 D30.A 26.35,14.45 28.89,14.45 29.53,15.72 33.97,15.72 34.29,15.4 36.35,15.4 36.67,15.72 40.96,15.72 D20.A 42.23,14.45 44.77,14.45 45.4,15.72 49.85,15.72 50.16,15.4 52.07,15.4 52.39,15.72 56.83,15.72 D10.A
  Bottom 0.305: IC2.11 82.55,47.47 86.28,43.74 88.66,43.74 89.77,42.62 89.77,36.51 89.14,35.88 86.84,35.88 U$1.D4
  Bottom 0.406: 77.95,47.47 IC2.11 75.64,47.47 73.5,49.61 73.5,60.01 71.6,61.59 60.96,61.59 60.01,60.64 D5.A
D5
  Top 0.254: 61.2,6.27 62.71,7.78 62.71,10.56 65.33,13.18 65.33,31.99
  Top 0.305: U$3.B10 49.85,7.62 51.2,6.27 61.2,6.27 | 65.33,31.99 69.22,35.88 D41.A 76.52,35.88 79.73,39.09 80.01,39.37 80.41,39.77 80.41,55.4 79.45,56.36 76.83,56.36 76.2,56.99 76.2,58.26 76.83,58.9 79.69,58.9 81.6,56.99 81.6,38.5 82.95,37.15 U$1.D5
D6
  Top 0.254: U$3.B9 53.74,6.75 60.96,6.75 62.31,8.1 62.31,10.79 64.93,13.41 64.93,33.02 69.77,37.86 73.74,37.86 D42.A
  Bottom 0.254: U$1.D6 80.96,34.61 D42.A
D7
  Bottom 0.305: U$3.B3 67.71,8.1 70.48,10.87 74.85,10.87 76.91,12.94 76.91,14.76 76.36,15.32 75.56,15.32 74.45,16.43 74.45,30.32 75.41,31.27 78.11,31.27 78.9,32.07 | 78.9,32.07 U$1.D7 | D43.A 72.63,39.85 78.9,33.58 78.9,32.07
GND  (via drill 0.6)  (2 unrouted)
  Top 0.305: U$3.A7 U$3.A6 | C5.2 14.53,11.27 15.56,10.24 28.5,10.24 C6.2 31.67,11.27 33.34,9.6 33.34,7.22 33.97,6.59 36.2,6.59 39.69,3.1 | 39.69,3.1 43.26,6.67 45.48,6.67 46.04,7.22 46.04,10 | U$3.A14 39.69,3.1 | C7.2 46.04,10.64 46.04,10 | C8.2 59.05,9.68 53.5,9.68 53.18,10 46.04,10 | IC1.7 76.91,32.62 78.66,32.62 81.76,35.72 84.22,35.72 86.6,38.1 86.6,40.72 U$1.GND
  Top 0.406: 55.4,64.61 53.98,64.61 | 53.98,64.61 40.32,64.61 | 24.45,64.61 12.54,64.61 11.27,63.34 C2.2 7.94,63.98 7.94,67.47 9.53,69.06 11.11,69.06 11.8,69.75 X1.8 | IC9.8 v34.61,42.39 32.7,40.48 | IC14.8 16.19,32.23 16.83,32.86 16.83,38.34 | IC13.8 12.38,42.39 13.65,41.12 16.43,41.12 16.83,40.72 16.83,38.34 | 55.56,64.61 56.36,64.61 | 56.36,64.61 71.83,64.61 | C1.2 56.2,64.45 56.36,64.61 | C3.2 40.32,64.61 | C4.2 24.45,64.61 | 24.45,64.61 29.37,64.61 | 29.37,64.61 30.96,64.61 31.59,63.98 35.72,63.98 36.35,64.61 40.32,64.61 | X2.8 44.67,70.86 42.23,68.42 35.24,68.42 34.45,67.63 34.45,65.72 33.97,65.25 32.54,65.25 31.91,65.88 31.91,67.79 31.43,68.26 29.84,68.26 29.37,67.79 29.37,64.61 | X3.8 77.53,70.38 76.36,69.22 56.2,69.22 53.98,66.99 53.98,64.61 | X4.8 88.32,62.65 87.63,63.34 87.63,66.04 86.2,67.47 83.5,67.47 81.2,65.17 75.8,65.17 75.25,64.61 71.83,64.61 | IC12.8 32.07,32.23 32.78,32.94 32.78,33.42 34.05,34.69 34.05,36.67 | C10.2 71.75,64.53 71.83,64.61 | 16.83,38.34 16.91,38.26 20.24,38.26 21.11,39.13 21.11,41.2 22.3,42.39 IC11.8 28.42,42.39 29.69,41.12 32.07,41.12 32.7,40.48 | 32.7,40.48 32.7,38.02 34.05,36.67 | 34.05,36.67 41.91,36.67 42.86,35.72 42.86,33.5 44.13,32.23 IC10.8 46.99,32.23 51.51,36.75 58.02,36.75 58.74,36.04 58.74,33.1 59.61,32.23 IC8.8 63.1,32.23 64.61,33.73 64.61,35.8 63.26,37.15 60.17,37.15 58.82,38.5 58.82,41.35 57.78,42.39 IC7.8
  Bottom 0.406: IC14.8 16.19,32.23 17.46,30.96 17.46,11.67 17.07,11.27 C5.2 | C3.2 35.24,63.34 33.66,61.75 33.66,43.34 v34.61,42.39 | IC1.7 75.41,32.54 73.82,30.96 | 73.82,30.96 73.82,15.72 C9.2 | IC2.8 69.85,42.39 68.58,41.12 68.58,36.2 | 68.58,36.2 73.82,30.96 | IC8.8 64.61,32.23 68.58,36.2
  pour Bottom (isolate 0.508): 0.64,0.48 91.28,0.48 91.28,72.71 0.64,72.71
IORQULA
  Top 0.305: IC7.15 67.47,57.63 68.74,58.9 72.71,58.9 76.04,62.23 81.76,62.23 83.19,60.8 83.19,47.47 84.45,46.2 88.66,46.2 89.14,45.72 89.53,45.32 90.65,44.21 90.65,24.21 89.77,23.18 81.12,23.18 78.11,26.19 75.64,26.19 75.09,25.64 75.09,23.5 76.2,22.38 IC1.3
  Top 0.406: IC8.15 53.66,18.26 52.39,18.26 52.07,18.57 50.16,18.57 49.85,18.26 40.32,18.26 IC10.15 37.78,18.26 36.51,18.26 36.2,18.57 34.29,18.57 33.97,18.26 24.45,18.26 IC12.15 21.91,18.26 20.64,18.26 20.32,18.57 18.41,18.57 18.1,18.26 8.57,18.26 IC14.15 5.08,19.21 5.08,23.34 2.06,26.35 2.06,51.12 4.76,53.82 8.89,53.82 12.7,57.63 IC13.15 15.56,57.63 16.83,56.36 18.1,56.36 18.41,56.67 20.32,56.67 20.64,56.36 29.53,56.36 IC11.15 32.07,56.36 33.97,56.36 34.29,56.67 36.2,56.67 36.51,56.36 45.4,56.36 IC9.15 47.94,56.36 49.85,56.36 50.16,56.67 52.07,56.67 52.39,56.36 60.64,56.36 61.91,57.63 IC7.15
KEMPSTON
  Top 0.305: IC2.15 79.85,57.63 81.12,56.36 81.12,35.96 79.53,34.37 75.01,34.37 73.18,32.54 IC1.8
N$1
  Top 0.406: D41.C 73.82,48.1 D42.C
  Bottom 0.406: D43.C 75.56,42.39 75.56,44.29 D41.C | IC2.13 76.99,52.55 75.72,51.28 D42.C
N$2
  Bottom 0.406: IC7.2 53.66,57.63 SPC.1
N$3
  Bottom 0.406: IC7.3 56.2,55.09 57.47,56.36 D1.C
N$4
  Top 0.406: IC1.10 IC1.11
N$5
  Bottom 0.406: X1.1 18.66,67.06 UPJ1.1
N$6
  Bottom 0.406: X1.2 15.92,67.27 DOWNJ1.1
N$7
  Bottom 0.406: X1.3 13.18,67.47 LEFTJ1.1
N$8
  Bottom 0.406: X1.4 10.43,67.67 RIGHTJ1.1
N$9
  Bottom 0.406: X1.5 7.69,67.88 PIN5J1.1
N$10
  Top 0.406: X1.6 17.29,69.07 18.1,68.26 20,68.26 FIREJ1.1
N$11
  Top 0.406: PIN9J1.1 6.67,67.31 9.05,69.69 9.05,71.57 X1.9
N$12
  Bottom 0.406: IC7.4 53.66,52.55 SYM.1
N$13
  Bottom 0.406: X2.1 51.52,69.94 50.01,68.42 47.47,68.42 UPJ2.1
N$14
  Bottom 0.406: X2.2 48.78,69.58 48.26,69.06 46.99,69.06 46.35,68.42 44.93,68.42 DOWNJ2.1
N$15
  Bottom 0.406: X2.3 46.04,69.37 45.72,69.06 44.45,69.06 43.81,68.42 42.39,68.42 LEFTJ2.1
N$16
  Bottom 0.406: X2.4 43.29,69.33 43.02,69.06 42.07,69.06 41.43,68.42 39.85,68.42 RIGHTJ2.1
N$17
  Bottom 0.406: X2.5 40.55,70.24 38.73,68.42 37.31,68.42 PIN5J2.1
N$18
  Top 0.406: IC7.6 53.66,47.47 M.1
N$19
  Bottom 0.406: IC7.5 53.66,50.01 53.02,49.37 53.02,40.48 53.66,39.85 D2.C
N$20
  Top 0.406: IC7.10 57.39,44.93 56.12,46.2 52.39,46.2 N.1
N$21
  Bottom 0.406: D3.C 57.47,46.2 56.2,44.93 IC7.7
N$22
  Top 0.406: IC7.12 63.66,50.01 64.45,49.21 64.45,44.13 63.98,43.66 53.66,43.66 51.12,41.12 B.1
N$23
  Bottom 0.406: D4.C 60.01,44.93 IC7.9
N$24
  Bottom 0.406: D5.C 60.01,50.01 IC7.11
N$25
  Bottom 0.305: IC8.2 61.28,15.72 60.64,14.53 59.37,13.26 52.47,13.26 CAP.1
N$26
  Bottom 0.406: Z.1 51.12,18.57 53.34,20.8 59.69,20.8 60.96,22.07 IC8.4
N$27
  Bottom 0.406: X.1 51.12,24.61 53.02,26.51 53.02,27.78 53.66,28.42 56.2,28.42 56.83,29.05 60.64,29.05 IC8.6
N$28
  Bottom 0.406: IC8.10 53.66,29.69 C.1
N$29
  Top 0.406: X2.6 50.15,68.57 FIREJ2.1
N$30
  Top 0.406: X2.9 36.5,71.58 33.18,68.26 PIN9J2.1
N$31  (via drill 0.6)
  Top 0.406: v10,64.61 10.48,65.09 10.48,67.15 11.59,68.26 13.18,68.26 14.55,69.63 X1.7
  Bottom 0.406: v10,64.61 5.87,64.61 PIN7J1.1
N$32
  Top 0.406: PIN7J2.1 30.64,66.04 32.07,64.61 35.24,64.61 35.88,65.25 46.51,65.25 47.15,65.88 47.15,69.53 47.47,69.85 47.47,71.53 X2.7
N$33
  Bottom 0.305: X3.1 84.39,68.83 83.66,68.1 73.03,68.1 UPJ3.1
N$34
  Bottom 0.305: X3.2 81.64,69.26 80.96,68.58 70.96,68.58 DOWNJ3.1
N$35
  Bottom 0.305: X3.3 78.9,69.37 78.58,69.06 68.9,69.06 LEFTJ3.1
N$36
  Bottom 0.406: IC2.2 69.37,57.63 RIGHT.1
N$37
  Bottom 0.406: IC2.4 69.37,52.55 LEFT.1
N$38
  Top 0.406: IC2.6 69.37,47.47 DOWN.1
N$39
  Top 0.406: IC2.10 75.72,44.93 74.77,43.97 73.34,43.97 72.39,44.93 72.39,45.56 71.75,46.2 68.1,46.2 UP.1
N$40
  Top 0.406: IC2.12 76.04,52.07 72.87,52.07 72.07,51.28 67.94,51.28 67.63,51.59 66.04,51.59 65.41,50.96 65.41,41.27 FIRE.1
N$41
  Bottom 0.305: X3.4 76.16,70.12 75.56,69.53 66.83,69.53 RIGHTJ3.1
N$42
  Bottom 0.305: X3.5 73.41,71.35 72.07,70.01 64.77,70.01 PIN5J3.1
N$43
  Top 0.406: X3.6 83.01,68.25 81.6,66.83 FIREJ3.1
N$44  (via drill 0.6)
  Top 0.406: X3.9 74.12,71.58 73.34,70.8 v63.02,70.8
  Bottom 0.406: v63.02,70.8 PIN9J3.1
N$45
  Top 0.406: X3.7 80.27,69.63 79.06,68.42 73.66,68.42 73.03,67.79 73.03,65.88 72.39,65.25 58.1,65.25 PIN7J3.1
N$46
  Bottom 0.406: UPJ4.1 86.52,50.8 90,54.28 X4.1
N$47
  Top 0.406: V.1 53.02,30.32 53.02,25.24 53.66,24.61 IC8.12
N$48
  Bottom 0.406: D6.C 60.01,18.26 61.28,19.53 IC8.3
N$49
  Bottom 0.406: D7.C 60.64,32.86 60.64,31.59 61.28,30.96 63.98,30.96 64.45,30.48 64.45,25.24 63.82,24.61 IC8.5
N$50
  Top 0.406: IC8.7 61.28,29.69 60.01,28.42 D8.C
N$51
  Top 0.406: D9.C 57.47,33.5 56.2,32.23 IC8.9
N$52
  Top 0.406: D10.C 57.47,24.61 IC8.11
N$53
  Bottom 0.406: IC9.2 37.78,57.63 ENT.1
N$54
  Bottom 0.406: IC9.4 37.78,52.55 L.1
N$55
  Top 0.406: IC9.6 37.78,47.47 K.1
N$56
  Top 0.406: J.1 36.51,43.66 40.64,43.66 41.91,44.93 IC9.10
N$57
  Top 0.406: H.1 36.51,41.12 40.32,41.12 42.86,43.66 47.94,43.66 48.58,44.29 48.58,48.1 IC9.12
N$58
  Bottom 0.406: D11.C 41.59,56.36 40.32,55.09 IC9.3
N$59
  Bottom 0.406: IC9.5 37.78,50.01 37.15,49.37 37.15,40.48 37.78,39.85 D12.C
N$60
  Bottom 0.406: IC9.7 40.32,44.93 41.59,46.2 D13.C
N$61
  Bottom 0.406: IC9.9 46.51,42.39 44.13,44.77 D14.C
N$62
  Bottom 0.406: D15.C 44.13,50.01 IC9.11
N$63
  Bottom 0.305: IC10.2 45.4,15.72 44.77,14.45 43.58,13.26 36.59,13.26 A.1
N$64
  Bottom 0.406: S.1 35.24,18.89 37.15,20.8 45.4,20.8 IC10.4
N$65
  Bottom 0.406: D.1 35.24,24.61 37.15,26.51 37.15,27.78 37.78,28.42 40.32,28.42 40.96,29.05 44.77,29.05 IC10.6
N$66
  Bottom 0.406: F.1 37.78,29.69 IC10.10
N$67
  Top 0.406: G.1 37.15,30.32 37.15,25.24 37.78,24.61 IC10.12
N$68
  Bottom 0.406: D16.C 44.13,18.26 45.4,19.53 IC10.3
N$69
  Bottom 0.305: D17.C 47.86,34.77 48.42,34.21 48.42,25.08 47.94,24.61 IC10.5
N$70
  Top 0.406: IC10.7 45.4,29.69 44.13,28.42 D18.C
N$71
  Top 0.406: D19.C 41.59,33.5 40.32,32.23 IC10.9
N$72
  Bottom 0.406: D20.C 41.59,24.61 IC10.11
N$73
  Bottom 0.406: DOWNJ4.1 86.2,53.34 87.63,54.77 87.63,57.78 88.27,58.42 89.89,58.42 X4.2
N$74
  Bottom 0.406: IC11.2 21.91,57.63 P.1
N$75
  Bottom 0.406: IC11.4 21.91,52.55 O.1
N$76
  Top 0.406: IC11.6 21.91,47.47 I.1
N$77
  Top 0.406: IC11.10 25.64,44.93 24.45,46.12 20.56,46.12 U.1
N$78
  Top 0.406: IC11.12 32.7,48.1 32.7,44.29 32.07,43.66 20.56,43.66 19.37,42.47 Y.1
N$79
  Bottom 0.406: D21.C 25.72,56.36 24.45,55.09 IC11.3
N$80
  Bottom 0.406: D22.C 22.23,39.85 21.27,40.8 21.27,49.37 22.23,50.32 22.86,50.32 IC11.5
N$81
  Bottom 0.406: D23.C 25.72,46.2 24.45,44.93 IC11.7
N$82
  Bottom 0.406: IC11.9 30.64,42.39 28.26,44.77 D24.C
N$83
  Bottom 0.406: D25.C 28.26,50.01 IC11.11
N$84
  Bottom 0.305: IC12.2 29.53,15.72 28.89,14.45 27.78,13.34 20.8,13.34 Q.1
N$85
  Bottom 0.406: W.1 19.37,18.89 21.27,20.8 29.53,20.8 IC12.4
N$86
  Bottom 0.406: E.1 19.37,24.61 21.27,26.51 21.27,27.78 21.91,28.42 24.45,28.42 25.08,29.05 28.89,29.05 IC12.6
N$87
  Bottom 0.406: R.1 21.91,29.69 IC12.10
N$88
  Top 0.406: T.1 21.27,30.32 21.27,25.24 21.91,24.61 IC12.12
N$89
  Bottom 0.406: IC12.3 29.53,19.53 28.26,18.26 D26.C
N$90
  Bottom 0.406: IC12.5 31.43,24.61 32.7,25.88 32.7,30.32 32.07,30.96 29.53,30.96 28.89,31.59 28.89,32.86 D27.C
N$91
  Top 0.406: D28.C 28.26,28.42 29.53,29.69 IC12.7
N$92
  Top 0.406: D29.C 25.72,33.5 24.45,32.23 IC12.9
N$93
  Bottom 0.406: D30.C 25.72,24.61 IC12.11
N$94
  Bottom 0.406: IC13.2 6.03,57.63 0.1
N$95
  Bottom 0.406: IC13.4 6.03,52.55 9.1
N$96
  Top 0.406: IC13.6 6.03,47.47 8.1
N$97
  Top 0.406: IC13.10 9.84,44.93 8.57,46.2 4.76,46.2 7.1
N$98
  Top 0.406: IC13.12 16.83,48.1 16.83,44.29 16.19,43.66 6.03,43.66 3.49,41.12 6.1
N$99
  Bottom 0.406: D31.C 9.84,56.36 8.57,55.09 IC13.3
N$100
  Bottom 0.406: D32.C 6.03,39.85 5.4,40.48 5.4,49.37 6.03,50.01 IC13.5
N$101
  Bottom 0.406: D33.C 9.84,46.2 8.57,44.93 IC13.7
N$102
  Bottom 0.406: IC13.9 14.61,42.39 12.38,44.61 D34.C
N$103
  Bottom 0.406: D35.C 12.38,50.01 IC13.11
N$104
  Bottom 0.305: IC14.2 13.65,15.72 13.02,14.37 12.06,14.37 10.95,13.26 4.84,13.26 1.1 4.05,12.46
N$105
  Bottom 0.406: 2.1 3.49,18.57 5.71,20.8 13.65,20.8 IC14.4
N$106
  Bottom 0.406: 3.1 3.49,24.61 5.4,26.51 5.4,27.78 6.03,28.42 8.57,28.42 9.21,29.05 13.02,29.05 IC14.6
N$107
  Bottom 0.406: 4.1 6.03,29.69 IC14.10
N$108
  Top 0.406: 5.1 5.4,30.32 5.4,25.24 6.03,24.61 IC14.12
N$109
  Bottom 0.406: D36.C 12.38,18.26 13.65,19.53 IC14.3
N$110
  Bottom 0.406: D37.C 13.02,32.86 13.02,31.59 13.65,30.96 16.19,30.96 16.83,30.32 16.83,25.88 15.56,24.61 IC14.5
N$111
  Top 0.406: D38.C 12.38,28.42 13.65,29.69 IC14.7
N$112
  Bottom 0.406: D39.C 9.84,33.5 8.57,32.23 IC14.9
N$113
  Top 0.406: D40.C 9.84,24.61 IC14.11
N$114
  Bottom 0.406: LEFTJ4.1 86.2,55.88 87,56.67 87,59.37 88.9,61.28 X4.3
N$115
  Bottom 0.406: RIGHTJ4.1 85.41,58.74 87.63,60.96 87.63,63.02 88.58,63.98 89.95,63.98 X4.4
N$116
  Bottom 0.406: PIN5J4.1 87,62.55 87,65.09 88.58,66.67 89.91,66.67 X4.5
N$117
  Top 0.406: X4.6 90,52.85 FIREJ4.1
N$118  (via drill 0.6)
  Top 0.406: X4.9 90,66.85 v87.63,69.22
  Bottom 0.406: v87.63,69.22 86.04,69.22 83.5,66.67 83.5,65.41 PIN9J4.1
N$119
  Top 0.406: X4.7 88.05,59.91 87,60.96 87,64.45 PIN7J4.1
VCC
  Top 0.305: IC14.16 8.49,13.26 8.65,13.26 | 8.65,13.26 23.26,13.26 | 23.26,13.26 24.61,13.26 | 24.61,13.26 39.21,13.26 | 39.21,13.26 40.32,13.26 | 40.32,13.26 54.85,13.26 | IC10.16 39.05,13.41 39.21,13.26 | C7.1 40.32,13.26 | IC12.16 23.18,13.34 23.26,13.26 | C6.1 24.45,13.1 24.61,13.26 | C5.1 8.57,13.18 8.65,13.26 | IC8.16 54.93,13.34 54.85,13.26 | U$3.A3 69.93,5.32 | 69.93,5.32 81.68,5.32 U$1.+5V | C9.1 70.33,10.56 68.9,9.13 68.9,6.35 69.93,5.32 | C8.1 55.56,12.54 54.85,13.26
  Top 0.406: 14.92,62.07 29.53,62.07 | 29.53,62.07 30.8,62.07 | 30.8,62.07 45.4,62.07 | 45.4,62.07 46.67,62.07 | IC9.16 46.67,62.07 | C3.1 45.4,62.07 | IC11.16 30.8,62.07 | C4.1 29.53,62.07 | IC13.16 14.92,62.07 | 0.79,62.07 0.79,17.62 3.97,14.45 IC14.16 | 0.79,62.07 0.79,65.56 VCCJ1.1 | 0.79,62.07 13.65,62.07 | 13.65,62.07 14.92,62.07 | C2.1 13.65,62.07 | C9.1 70.33,16.19 IC1.14 | 46.67,62.07 61.44,62.07 | 61.44,62.07 62.55,62.07 | 62.55,62.07 73.82,62.07 75.64,63.9 C10.1 | IC7.16 62.55,62.07 | C1.1 61.28,62.23 61.44,62.07
  Bottom 0.305: C8.1 58.82,11.27 60.48,12.94 64.85,12.94 IC1.14
  Bottom 0.406: IC2.14 77.15,55.09 76.2,56.04 76.2,58.26 IC2.16 78.11,62.07 C10.1 | VCCJ2.1 24.61,66.83 21.11,63.34 C2.1
  pour Top (isolate 0.508): 0.64,0.48 91.28,0.48 91.28,72.71 0.64,72.71

### Text on the board
tPlace: Vc | 7 | Vc | 7 | 9 | 5 | R | L | D | U | F | Vc | 7 | 9 | 5 | R | L | D | U | F | 9 | 5 | 0 | P | SPC | Ri | R | ENT | L | 9 | O | L | Le | D | SYM | U | I | 8 | K | M | Dn | F | 7 | U | J | N | Up | 6 | Y | H | B | Fi | Vc | 7 | 5 | 9 | T | G | V | 5 | 4 | R | R | F | C | L | D | 3 | E | D | X | U | F | 2 | W | S | Z | 1 | Q | A | CAP
tNames: COMCON-style Joystick Interface / (C)2015 antoniovillena
bNames: COMCON-style Joystick Interface / (C)2015 antoniovillena